# EAGLE design FPA_Version1.0_Nodeself (EAGLE 6.5.0)
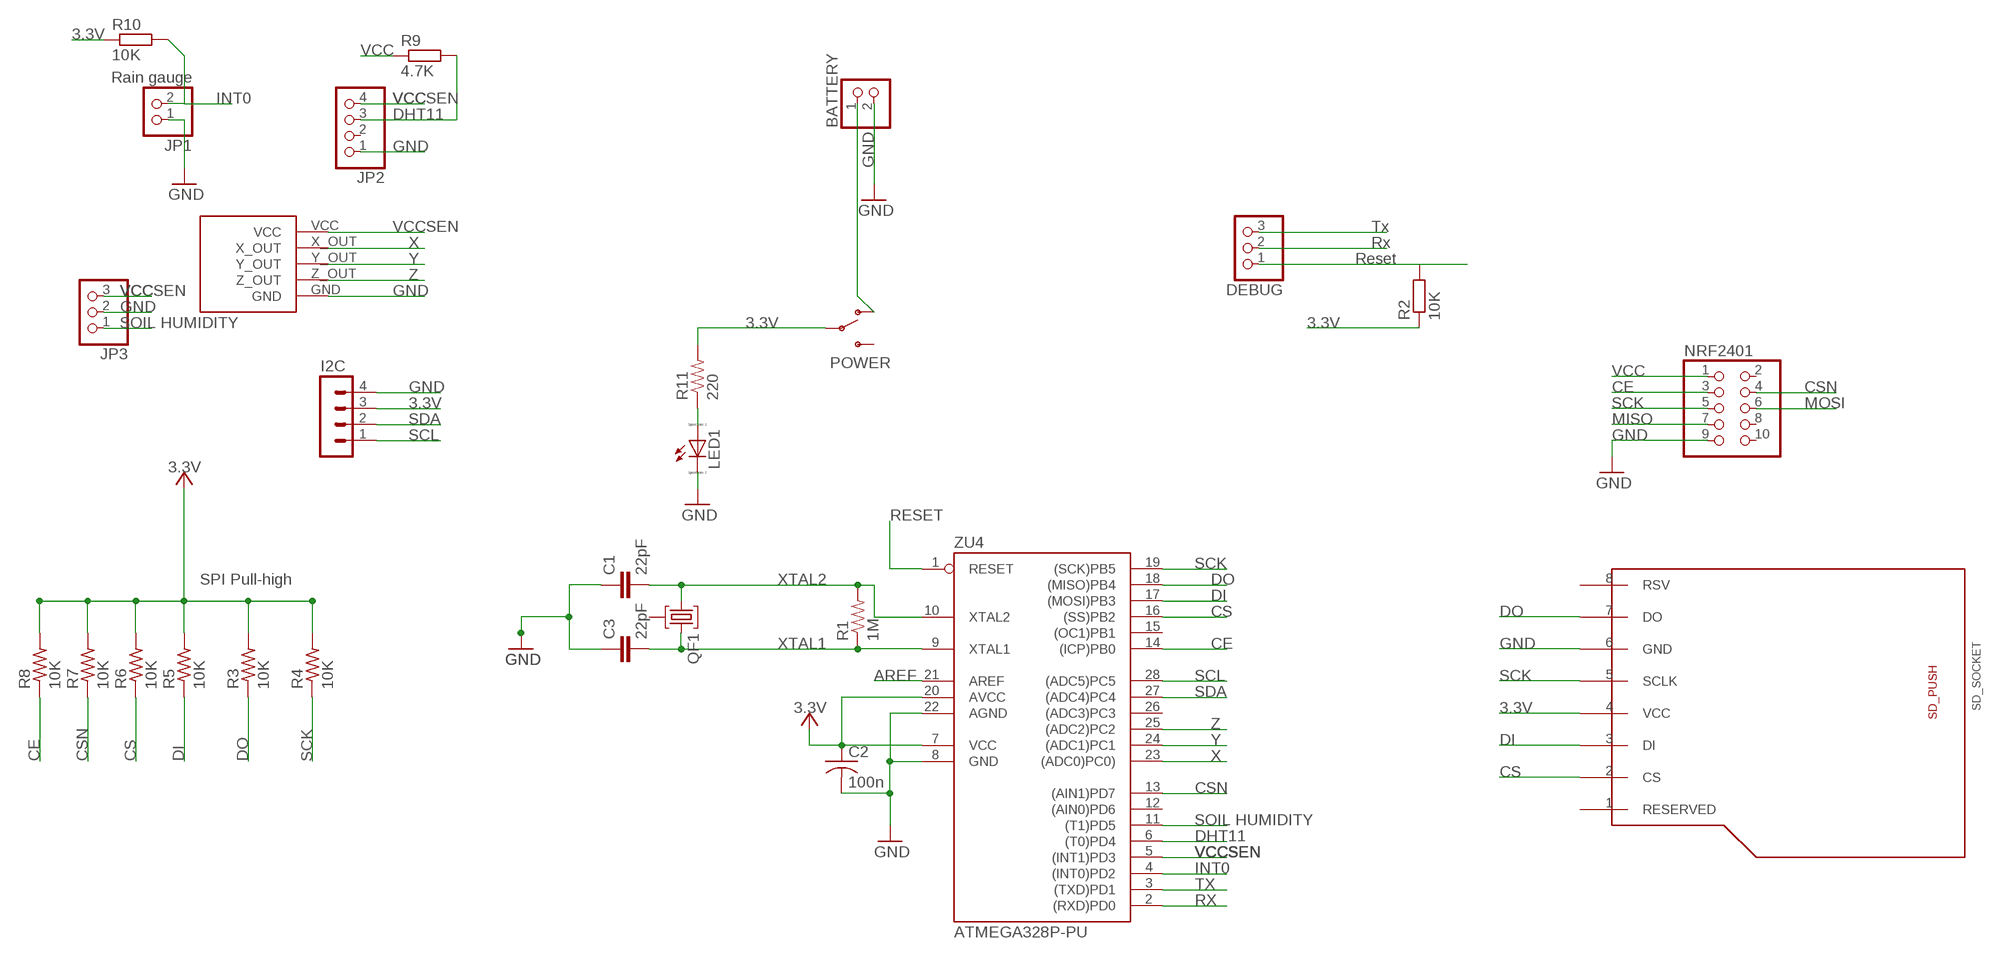
[diagram p0: schematic, sheet 1]

## Parts
BATTERY  PINHD-1X2  [1X02]
C1  22pF  C-EUC0805  [C0805]
C2  100n  C-USC1206  [C1206]
C3  22pF  C-EUC0805  [C0805]
DEBUG  PINHD-1X3  [1X03]
I2C  MA04-1  [MA04-1]
JP1  Rain gauge  PINHD-1X2  [1X02]
JP2  PINHD-1X4  [1X04]
JP3  PINHD-1X3  [1X03]
LED1  LED_E  [LED_1206]
NRF2401  PINHD-2X5  [2X05]
POWER  SWITCH-SPSTPTH  [SWITCH-SPDT]
QF1  10M8AHC49U  [HC49U]
R1  1M  RESISTOR1206  [1206]
R2  10K  R-EU_R1206  [R1206]
R3  10K  R-US_R0805  [R0805]
R4  10K  R-US_R0805  [R0805]
R5  10K  R-US_R0805  [R0805]
R6  10K  R-US_R0805  [R0805]
R7  10K  R-US_R0805  [R0805]
R8  10K  R-US_R0805  [R0805]
R9  4.7K  R-EU_M1206  [M1206]
R10  10K  R-EU_M1206  [M1206]
R11  220  RESISTOR1206  [1206]
SD_SOCKET  SD_CARD_SOCKET  [SD_CARD_SOCKET]
U$2  GY-61  [GY-61]
ZU4  ATMEGA328P-PU  [DIL28-3]

## Nets
3.3V: C2.1 I2C.3 NRF2401.1 POWER.2(P) R2.1 R3.2 R4.2 R5.2 R6.2 R7.2 R8.2 R9.1 R10.1 R11.2 SD_SOCKET.4(VCC) ZU4.7(VCC) ZU4.20(AVCC) ; supply symbol labelled +5V
AREF [aref]: ZU4.21(AREF)
CE: NRF2401.3 R8.1 ZU4.14((ICP)PB0)
CSN: NRF2401.4 R7.1 ZU4.13((AIN1)PD7)
GND [gnd]: BATTERY.2 C1.1 C2.2 C3.1 I2C.4 JP1.1 JP2.1 JP3.2 LED1.C NRF2401.9 SD_SOCKET.6(GND) U$2.GND ZU4.8(GND) ZU4.22(AGND)
HRX: DEBUG.2 ZU4.3((TXD)PD1)
HTX: DEBUG.3 ZU4.2((RXD)PD0)
INT0: JP1.2 R10.2 ZU4.4((INT0)PD2)
MISO: NRF2401.7 R3.1 SD_SOCKET.7(DO) ZU4.18((MISO)PB4)
MOSI: NRF2401.6 R5.1 SD_SOCKET.3(DI) ZU4.17((MOSI)PB3)
N$5: BATTERY.1 POWER.1(O)
N$6: LED1.A R11.1
RESET: DEBUG.1 R2.2 ZU4.1(RESET)
SCK: NRF2401.5 R4.1 SD_SOCKET.5(SCLK) ZU4.19((SCK)PB5)
SCL: I2C.1 ZU4.28((ADC5)PC5)
SDA: I2C.2 ZU4.27((ADC4)PC4)
SS: R6.1 SD_SOCKET.2(CS) ZU4.16((SS)PB2)
T0: JP2.3 R9.2 ZU4.6((T0)PD4)
T1: JP3.1 ZU4.11((T1)PD5)
VCCSEN: JP2.4 JP3.3 U$2.VCC ZU4.5((INT1)PD3)
X: U$2.X_OUT ZU4.23((ADC0)PC0))
XTAL1: C3.2 QF1.3 R1.1 ZU4.9(XTAL1)
XTAL2: C1.2 QF1.1 R1.2 ZU4.10(XTAL2)
Y: U$2.Y_OUT ZU4.24((ADC1)PC1)
Z: U$2.Z_OUT ZU4.25((ADC2)PC2)
Unconnected: JP2.2 NRF2401.2 NRF2401.8 NRF2401.10 POWER.3(S) QF1.2 SD_SOCKET.1(RESERVED) SD_SOCKET.8(RSV) ZU4.12((AIN0)PD6) ZU4.15((OC1)PB1) ZU4.26((ADC3)PC3)

## Notes on the sheet
- 3.3V
- VCC
- INT0 | VCC
- DHT11
- GND
- GND
- Tx
- X | Rx
- Y | Reset
- Z
- VCC | GND
- GND
- SOIL HUMIDITY | 3.3V | 3.3V
- VCC
- GND | CE | CSN
- 3.3V | SCK | MOSI
- SDA | MISO
- SCL | GND
- 3.3V
- RESET
- SCK
- SPI Pull-high | DO
- DI
- CS | DO
- CE | GND
- SCL | SCK
- SDA
- 3.3V
- Z
- Y | DI
- CE | CSN | CS | DI | DO | SCK | X
- CS
- CSN
- SOIL HUMIDITY
- DHT11
- INT0
- TX
- RX

## Library data of the parts
BATTERY JP1 = pinhead:PINHD-1X2: PIN HEADER
C1 C3 = rcl:C-EU: CAPACITOR, European symbol
C2 = adafruit:C-US: CAPACITOR, American symbol
DEBUG JP3 = pinhead:PINHD-1X3: PIN HEADER
I2C = con-lstb:MA04-1: PIN HEADER; OC_FARNELL: unknown; OC_NEWARK: unknown
JP2 = pinhead:PINHD-1X4: PIN HEADER
LED1 = eagle-ltspice:LED_E: LED Source: http://www.osram.convergy.de Source: www.luxeon.com Source: www.kingbright.com; SPICEMODEL: NONE; SPICEPREFIX: D; SPICETYPE: diode
NRF2401 = pinhead:PINHD-2X5: PIN HEADER
POWER = SparkFun:SWITCH-SPST: SPST Switch Simple slide switch. Spark Fun Electronics SKU : COM-00102
QF1 = crystal:10M*A: Monolithic Crystal Filters Source: www.vanlong.com; OC_FARNELL: unknown; OC_NEWARK: unknown
R1 R11 = SparkFun:RESISTOR: Resistor Basic schematic elements and footprints for 0603, 1206, and PTH 1/10th watt (small) resistors.
R2 R9 R10 = rcl:R-EU_: RESISTOR, European symbol
R3-R8 = adafruit:R-US_: RESISTOR, American symbol
SD_SOCKET = NXP-74HC4050D:SD_CARD_SOCKET
U$2 = NXP-74HC4050D:GY-61
ZU4 = SmartPrj:ATMEGA328P-: MICROCONTROLLER 4 Kbytes FLASH 128 bytes SRAM 256 bytes EEPROM UART 6-channel 10 bit ADC

## Net classes
0 default: width 0.254 mm, clearance 0.254 mm
1 power: width 0.61 mm, drill 0.61 mm, clearance 0.254 mm
2 gnd: width 0.305 mm, drill 0.559 mm, clearance 0.254 mm
3 usbvcc: width 0.508 mm, drill 0.61 mm, clearance 0.254 mm
4 aref: width 0.406 mm, drill 0.61 mm, clearance 0.254 mm

## Board
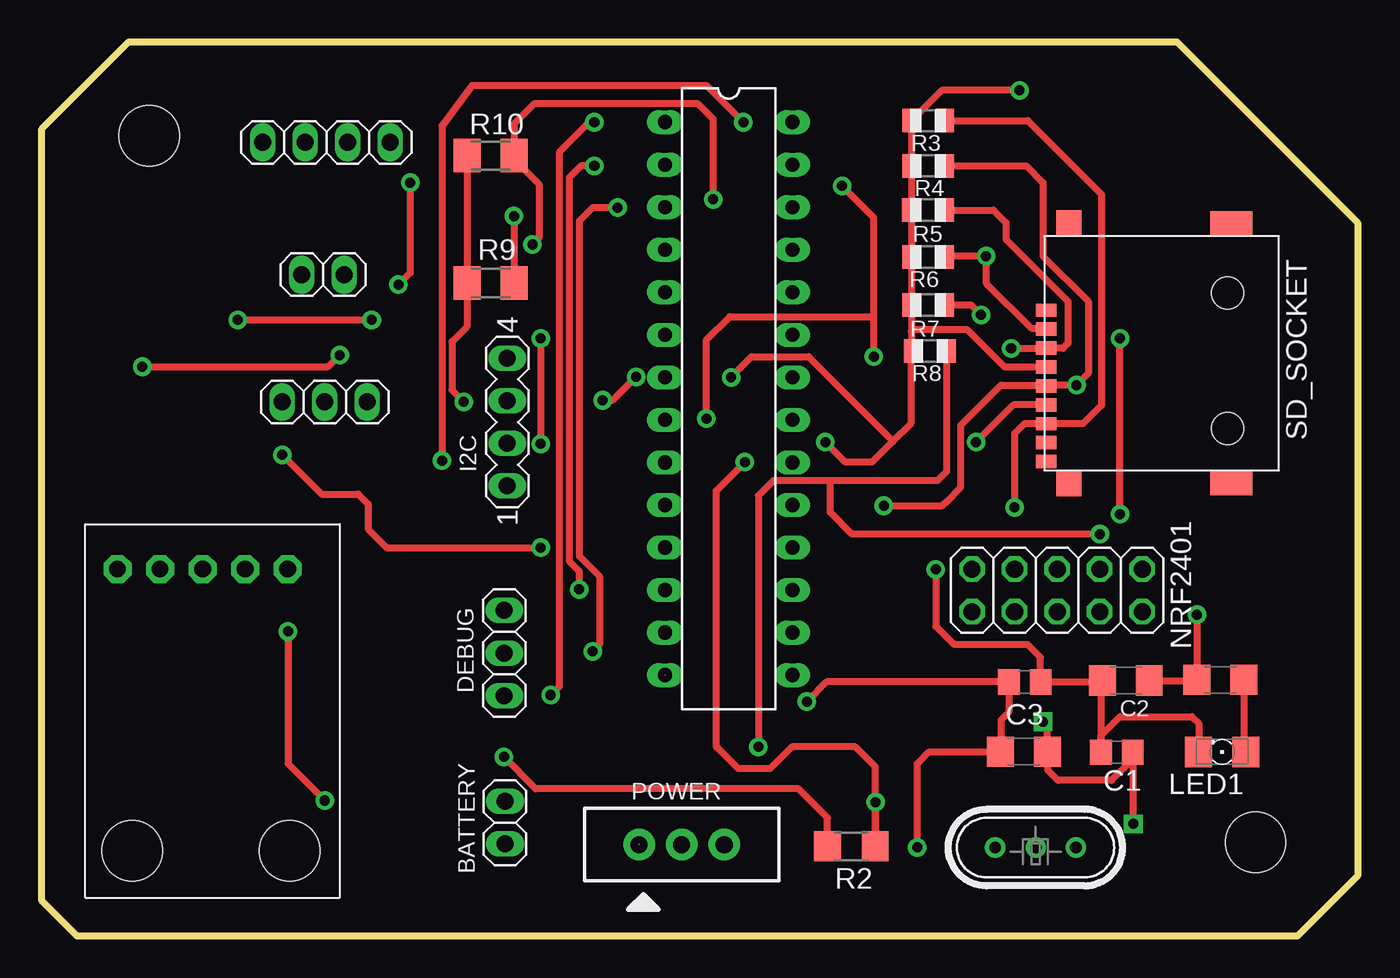
[diagram p1: board, top side]
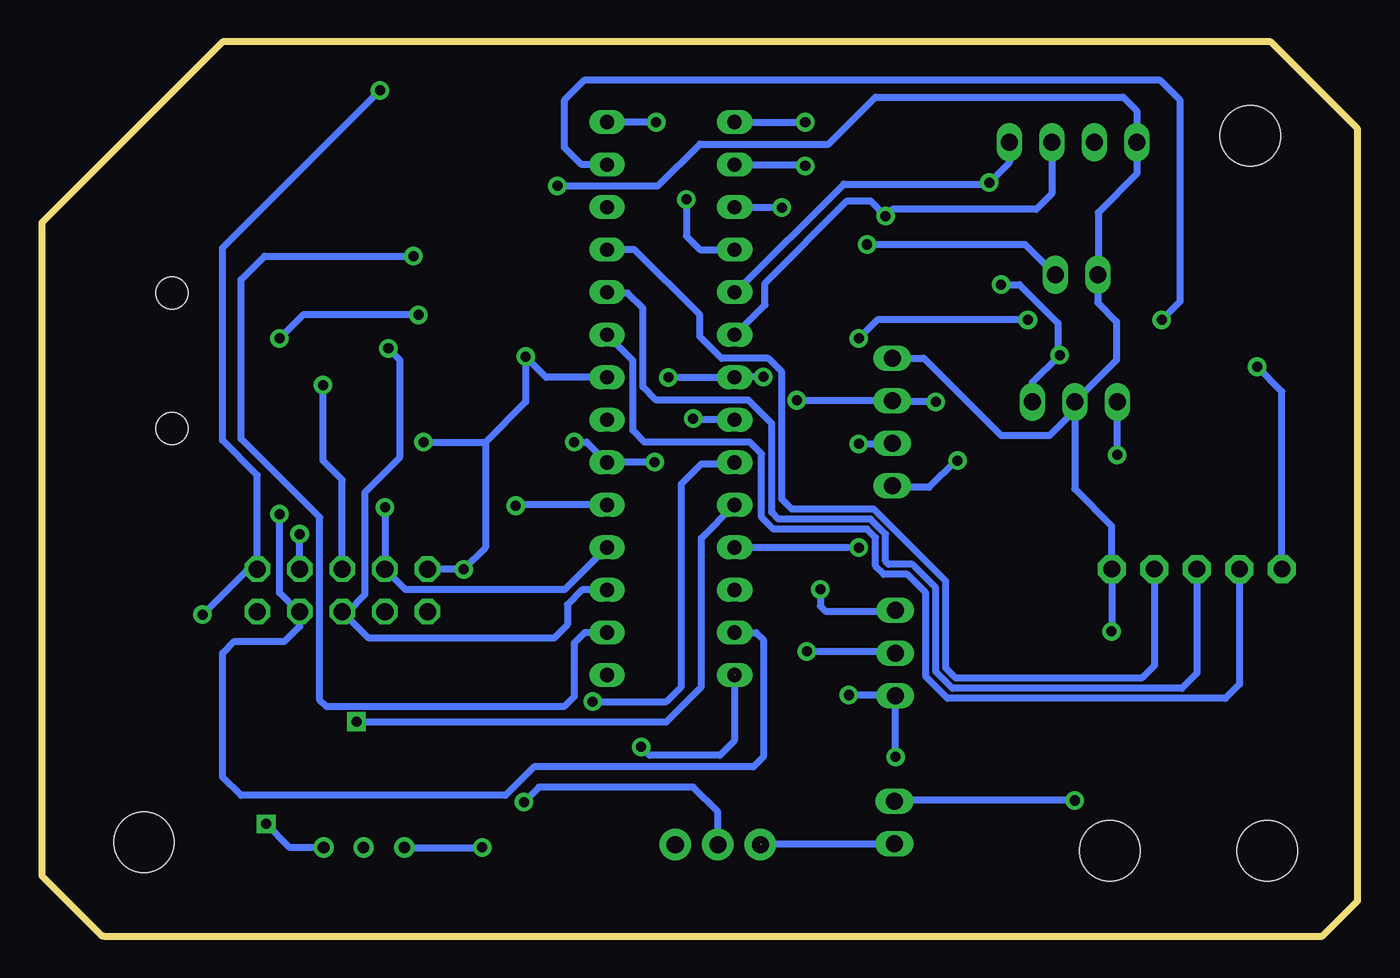
[diagram p2: board, bottom side, seen from below]

Size 78.6 x 53.4 mm. Coordinates in mm from the lower left corner, seen from the top.
Outline: 75,0 78.6,3.6 78.6,42.6 67.8,53.4 5.2,53.4 0,48.2 0,2.1 2.1,0 74.9,0
Copper layers (1*16): Top 0.035mm / dielectric 1.5mm / Bottom 0.035mm
Design rules "default": minimum track width 10mil, minimum drill 22mil, track to track 10mil, track to pad 10mil, pad to pad 10mil, via to via 12mil, smd to smd 8mil, copper to edge 26mil, drill to drill 12mil, minimum pad ring 10mil, minimum via ring 10mil, stop-mask expansion 1mil, vias tented up to drill 30mil, thermal gap 10mil
Holes 3.6 mm at 6.4,47.8 5.4,5.1 72.5,5.6
vRestrict: area 22.4,44 to 24.1,49; area 24.9,45.4 to 26.6,49; area 27.9,45.2 to 29.1,48.7; area 30.5,45.2 to 31.6,48.7; area 33,45.2 to 34.2,48.7; area 35.6,45.2 to 36.7,48.7; area 38.2,47.1 to 39.4,48.7; area 39.8,45 to 47.1,46.8; area 59.8,44.1 to 61.2,46.6; area 62.4,44.1 to 63.8,46.6; area 60.8,35.7 to 64.3,37.1; area 0.1,21.7 to 1.5,30; 14 more areas

### Footprints (pad centres in the part's own frame; a part is rotated, then mirrored left to right if it is on the bottom)
1X02 = drill 1.016 long: 1 -1.27,0; 2 1.27,0
C0805 = smd 1.3 x 1.5: 1 -0.95,0; 2 0.95,0
C1206 = smd 1.6 x 1.8: 1 -1.4,0; 2 1.4,0
1X03 = drill 1.016 long: 1 -2.54,0; 2 0,0; 3 2.54,0
MA04-1 = drill 1.016 long: 1 -3.81,0; 2 -1.27,0; 3 1.27,0; 4 3.81,0
1X04 = drill 1.016 long: 1 -3.81,0; 2 -1.27,0; 3 1.27,0; 4 3.81,0
LED_1206 = smd 1.6 x 1.803: A -1.422,0; C 1.422,0
2X05 = drill 1.016 octagon: 1 -5.08,-1.27; 2 -5.08,1.27; 3 -2.54,-1.27; 4 -2.54,1.27; 5 0,-1.27; 6 0,1.27; 7 2.54,-1.27; 8 2.54,1.27; 9 5.08,-1.27; 10 5.08,1.27
SWITCH-SPDT = drill 1.016 pad 1.88: 1 0,2.54; 2 0,0; 3 0,-2.54
HC49U = drill 0.7 pad 1.2: 1 -2.413,0; 2 -0.027,0; 3 2.413,0
1206 = smd 1.6 x 1.8: 1 -1.4,0; 2 1.4,0
R1206 = smd 1.6 x 1.803: 1 -1.422,0; 2 1.422,0
R0805 = smd 1.1 x 1.4: 1 -1,0; 2 1,0
M1206 = smd 1.6 x 2: 1 -1.4,0; 2 1.4,0
SD_CARD_SOCKET = smd 0.8 x 1.2: 1 3.16,7.04; 2 2.03,7.04; 3 0.9,7.04; 4 -0.23,7.04; 5 -1.36,7.04; 6 -2.49,7.04; 7 -3.62,7.04; 8 -4.75,7.04; 9 -5.88,7.04 | smd 1.5 x 1.5: P$11 -7.19,5.68; P$12 8.38,5.68 | smd 1.4 x 2.5: P$13 8.37,-4.02; P$14 -7.18,-4.02 | hole 1.9: -3.91,-3.81; 4.18,-3.81
GY-61 = drill 1 pad 1.676 octagon: GND 7.62,-5.08; VCC 7.62,5.08; X_OUT 7.62,2.54; Y_OUT 7.62,0; Z_OUT 7.62,-2.54 | hole 3.6: -9.2,4.2; -9.2,-5.2
DIL28-3 = drill 0.85 pad 1.422 long: 1 -16.51,-3.81; 2 -13.97,-3.81; 3 -11.43,-3.81; 4 -8.89,-3.81; 5 -6.35,-3.81; 6 -3.81,-3.81; 7 -1.27,-3.81; 8 1.27,-3.81; 9 3.81,-3.81; 10 6.35,-3.81; 11 8.89,-3.81; 12 11.43,-3.81; 13 13.97,-3.81; 14 16.51,-3.81; 15 16.51,3.81; 16 13.97,3.81; 17 11.43,3.81; 18 8.89,3.81; 19 6.35,3.81; 20 3.81,3.81; 21 1.27,3.81; 22 -1.27,3.81; 23 -3.81,3.81; 24 -6.35,3.81; 25 -8.89,3.81; 26 -11.43,3.81; 27 -13.97,3.81; 28 -16.51,3.81

### Placement (x,y rotation side)
BATTERY  27.66,6.78 90 top
C1  64.21,10.98 0 top
C2  64.74,15.26 180 top
C3  58.71,15.18 180 top
DEBUG  27.62,16.91 90 top
I2C  27.8,30.7 90 top
JP1  16.8,39.5 0 top
JP2  17,47.4 0 top
JP3  16.9,31.9 0 top
LED1  70.5,11 180 top
NRF2401  60.65,20.65 180 top
POWER  38.22,5.47 90 top
QF1  59.36,5.29 180 top
R1  58.66,11.02 0 top
R2  48.36,5.36 180 top
R3  52.94,48.69 180 top
R4  52.95,46 180 top
R5  52.94,43.36 180 top
R6  52.94,40.55 180 top
R7  52.94,37.69 180 top
R8  53.04,34.94 180 top
R9  26.8,39 0 top
R10  26.8,46.6 0 top
R11  70.4,15.3 180 top
SD_SOCKET  67.03,34.21 90 top
U$2  9.6,14.3 90 top
ZU4  41.03,32.1 270 top

### Tracks (layer width: path | path; a pad name or v marks a point on that pad's centre or on a via)
3.3V  (via drill 0.6)
  Top 0.406: R10.1 R9.1 25.4,36.4 24.5,35.5 24.5,32.6 v25.2,31.9 | 51.94,36.1 R7.2 R6.2 R5.2 R4.2 R3.2 53.75,50.5 v58.4,50.5 | 51.94,36.1 51.94,35.04 R8.2 51.94,34.94 51.9,34.9 51.9,30.6 50.85,29.55 | C2.1 68.96,15.26 R11.2 v69,19.2 | 50.85,29.55 49.6,28.3 48,28.3 v46.8,29.5 | v41.17,33.37 42.4,34.6 45.8,34.6 50.85,29.55 | v33.5,32 34.1,32 v35.5,33.4 | v49.8,8 49.8,5.38 R2.1 49.78,10.12 48.6,11.3 44.8,11.3 43.5,10 41.6,10 40.3,11.3 40.3,26.6 v42,28.3 | SD_SOCKET.4 57.52,33.98 55.3,36.2 52.04,36.2 51.94,36.1
  Bottom 0.406: v33.5,32 33.47,31.97 I2C.3 27.73,31.9 v25.2,31.9 | v46.8,29.5 46.05,29.5 ZU4.20 v42,28.3 | v41.17,33.37 ZU4.7 37.19,33.4 v35.5,33.4 | v58.4,50.5 67.8,41.1 67.8,29.6 65.73,27.53 NRF2401.1 66.28,21.92 v69,19.2 | POWER.2 38.22,7.42 39.7,8.9 48.9,8.9 v49.8,8
CE  (via drill 0.6)  (1 unrouted)
  Top 0.406: R8.1 54.04,27.74 53.5,27.2 47.1,27.2 | 47.1,27.2 43.7,27.2 42.8,26.3 v42.8,11.3 | v63.2,24 48.4,24 47.1,25.3 47.1,27.2
  Bottom 0.406: 37.23,15.6 37.23,11.67 38.1,10.8 42.3,10.8 v42.8,11.3 | NRF2401.3 v63.19,23.99 v63.2,24
CSN  (via drill 0.6)
  Top 0.406: R7.1 55.51,37.69 v56.1,37.1 | v64.4,25.2 v64.4,35.7
  Bottom 0.406: ZU4.13 35.93,18.13 35.5,17.7 35.5,10.7 36.1,10.1 49.2,10.1 50.9,8.4 66.7,8.4 67.8,9.5 67.8,16.9 67.1,17.6 64.1,17.6 63.2,18.5 NRF2401.4 63.28,19.38 64.4,20.5 v64.4,25.2 | v56.1,37.1 63,37.1 v64.4,35.7
GND  (via drill 0.6)
  Top 0.406: 63.26,15.18 C3.1 59.66,16.64 58.9,17.4 54.5,17.4 53.4,18.5 v53.4,21.9 | 63.26,15.18 C2.2 | 63.26,15.18 C1.1 63.26,11.96 64.4,13.1 68.7,13.1 69.1,12.7 69.1,11.02 LED1.C | 27.61,8.1 BATTERY.2 | v49.7,34.6 49.7,37 | 49.7,37 49.7,42.9 v47.8,44.8 | v39.7,30.9 39.7,35.6 41.1,37 49.7,37 | SD_SOCKET.6 58.02,31.72 v55.8,29.5 | v14.7,18.2 14.7,10.3 v16.9,8.1
  Bottom 0.406: 16.9,31.4 JP3.2 14.4,34.4 14.4,36.7 15.53,37.83 JP1.1 15.5,39.53 15.5,43.2 13.19,45.51 JP2.1 13.2,49.3 14,50.1 28.8,50.1 31.6,47.3 39.3,47.3 41.8,44.8 v47.8,44.8 | 16.9,31.4 16.9,26.7 14.7,24.5 14.7,21.94 U$2.GND 14.68,18.22 v14.7,18.2 | I2C.4 25.91,34.51 21.3,29.9 18.4,29.9 16.9,31.4 | ZU4.22 48.47,33.37 v49.7,34.6 49.7,31.9 52.1,29.5 | ZU4.8 39.7,30.83 v39.7,30.9 | 52.1,29.5 52.1,23.2 v53.4,21.9 55.55,21.9 NRF2401.9 | v55.8,29.5 52.1,29.5 | v16.9,8.1 27.61,8.1 BATTERY.2
HRX  (via drill 0.6)
  Top 0.406: v34.4,43.5 32.9,43.5 32.1,42.7 32.1,22.7 33.3,21.5 33.3,17.4 v32.9,17
  Bottom 0.406: ZU4.3 34.43,43.53 v34.4,43.5 | v32.9,17 27.72,17 DEBUG.2
HTX  (via drill 0.6)
  Top 0.406: v33,46 32.2,46 31.5,45.3 31.5,22.4 32.1,21.8 v32.1,20.7
  Bottom 0.406: ZU4.2 33.07,46.07 v33,46 | v32.1,20.7 32.1,19.7 31.8,19.4 27.67,19.4 DEBUG.3
INT0  (via drill 0.6)
  Top 0.406: v29.3,41.3 29.7,41.7 29.7,44.9 28.2,46.4 R10.2 28.2,48.5 29.4,49.7 39.2,49.7 40.1,48.8 v40.1,44
  Bottom 0.406: v29.3,41.3 19.87,41.3 JP1.2 | v40.1,44 40.1,41.8 39.3,41 37.23,41 ZU4.4
MISO  (via drill 0.6)
  Top 0.406: R3.1 58.91,48.69 63.3,44.3 63.3,31.7 62.2,30.6 SD_SOCKET.7 | SD_SOCKET.7 | SD_SOCKET.7 58.7,30.6 58.1,30 v58.1,25.6 | NRF2401.7
  Bottom 0.406: ZU4.18 47.35,20.7 56.9,20.7 NRF2401.7 v58.1,25.6
MOSI  (via drill 0.6)
  Top 0.406: R5.1 56.84,43.36 57.6,42.6 57.6,41.6 61.3,37.9 61.3,35.4 61,35.1 60,35.1 SD_SOCKET.3 59.98,35.1 v57.9,35.1
  Bottom 0.406: ZU4.17 46.33,20.67 47.2,19.8 47.2,18.6 48,17.8 59.07,17.8 NRF2401.6 60.32,19.38 59.3,20.4 59.3,26.5 57.2,28.6 57.2,34.4 v57.9,35.1
N$5  (1 unrouted)
  Bottom 0.406: 35.65,5.51 BATTERY.1
N$6
  Top 0.406: R11.1 71.8,11.12 LED1.A
RESET  (via drill 0.6)
  Top 0.406: R2.2 46.94,7.06 45.2,8.8 29.5,8.8 v27.6,10.7 | v33,48.6 32.7,48.6 30.9,46.8 30.9,14.9 v30.4,14.4
  Bottom 0.406: v27.6,10.7 27.6,14.34 DEBUG.1 27.66,14.4 v30.4,14.4 | ZU4.1 v33.01,48.61 v33,48.6
SCK  (via drill 0.6)
  Top 0.406: R4.1 58.8,46 59.8,45 59.8,40.6 62.5,37.9 62.5,33.6 v61.8,32.9 60.03,32.9 SD_SOCKET.5 59.94,32.9 57.3,32.9 54.9,30.5 54.9,26.8 54.05,25.95 53.85,25.75 53.8,25.7 v50.3,25.7
  Bottom 0.406: NRF2401.5 60.65,27.25 61.8,28.4 v61.8,32.9 | ZU4.19 50.25,25.75 v50.3,25.7
SCL  (via drill 0.6)
  Top 0.406: v23.9,28.4 23.9,48.4 25.7,50.8 39.7,50.8 v41.9,48.6 | 27.71,26.8 I2C.1
  Bottom 0.406: v41.9,48.6 ZU4.28 | v23.9,28.4 24,28.4 25.6,26.8 27.71,26.8 I2C.1
SDA  (via drill 0.6)
  Top 0.406: v11.7,36.8 v19.7,36.8 | v29.8,35.7 v29.8,29.4
  Bottom 0.406: v11.7,36.8 10.6,37.9 10.6,49.9 11.8,51.1 46.2,51.1 47.4,49.9 47.4,47.1 46.4,46.1 44.87,46.1 ZU4.27 | v19.7,36.8 28.7,36.8 v29.8,35.7 | v29.8,29.4 27.83,29.4 I2C.2
SS  (via drill 0.6)
  Top 0.406: R6.1 54,40.6 v56.4,40.6 56.4,39 59.1,36.3 59.93,36.3 SD_SOCKET.2
  Bottom 0.406: ZU4.16 46.17,18.13 46.8,17.5 46.8,14.3 47.4,13.7 61.6,13.7 62,14.1 62,25 66.7,29.7 66.7,39.2 65.3,40.6 v56.4,40.6
T0  (via drill 0.6)
  Top 0.406: v28.2,43 R9.2
  Bottom 0.406: JP2.3 18.27,44.33 19.2,43.4 27.8,43.4 v28.2,43 29.1,43.9 30.5,43.9 35.4,39 35.4,37.7 37.19,35.91 ZU4.6
T1  (via drill 0.6)
  Top 0.406: v14.36,28.74 16.7,26.4 18.9,26.4 19.5,25.8 19.5,24.3 20.6,23.2 v29.8,23.2
  Bottom 0.406: v29.8,23.2 ZU4.11 | v14.36,28.74 JP3.1
VCCSEN  (via drill 0.6)
  Top 0.406: v6,34 17.1,34 v17.8,34.7 | v22,45 22,39.6 v21.3,38.9
  Bottom 0.406: U$2.VCC 4.52,32.52 v6,34 | JP2.4 20.81,46.19 v22,45 22.1,44.9 30.7,44.9 37.15,38.45 ZU4.5 37.25,38.45 37.3,38.5 | v21.3,38.9 20.2,38.9 17.9,36.6 17.9,34.8 v17.8,34.7 19.44,33.06 JP3.3
X
  Bottom 0.406: U$2.X_OUT 7.06,15.04 7.9,14.2 24.5,14.2 25.8,15.5 25.8,20.5 26.9,21.6 28.3,21.6 28.8,22.1 28.8,23.8 29.3,24.3 34.9,24.3 35.6,25 35.6,28.8 36.3,29.5 42.6,29.5 43.3,30.2 43.3,34.37 ZU4.23
XTAL1  (via drill 0.6)
  Top 0.406: v45.7,14 46.88,15.18 C3.2 57.76,13.36 57.3,12.9 57.3,11.05 R1.1 57.25,11 53,11 52.3,10.3 v52.3,5.3
  Bottom 0.406: v45.7,14 41.3,14 40.4,14.9 40.4,27 39.2,28.2 37.31,28.2 ZU4.9 | QF1.3 v52.31,5.29 v52.3,5.3
XTAL2  (via drill 0.6)
  Top 0.406: v65.2,6.7 65.2,10.94 C1.2 65.16,10.56 63.9,9.3 60.7,9.3 60.1,9.9 60.1,10.98 R1.2 60.06,12.54 v59.8,12.8
  Bottom 0.406: QF1.1 63.79,5.29 v65.2,6.7 | v59.8,12.8 41.3,12.8 39.2,14.9 39.2,23.77 ZU4.10
Y
  Bottom 0.406: U$2.Y_OUT 9.6,15.7 10.5,14.8 24.2,14.8 25.2,15.8 25.2,20.8 26.6,22.2 28,22.2 28.2,22.4 28.2,24 29.1,24.9 34.6,24.9 35,25.3 35,30.6 36.4,32 41.9,32 42.7,32.8 42.7,37.5 43.6,38.4 44.79,38.4 ZU4.24
Z
  Bottom 0.406: U$2.Z_OUT 12.14,16.16 12.9,15.4 24,15.4 24.6,16 24.6,21.2 28.9,25.5 33.8,25.5 34.4,26.1 34.4,33.7 35.2,34.5 38,34.5 39.3,35.8 39.3,37.1 43.2,41 ZU4.25

### Text on the board
ReferenceLC: L | TX | ON | RX | PC1 | PC2
214bmp: D:/SmartProjects/Snc/a4_bn_logo2.bmp